# EAGLE design BreakOutBoardIpod (EAGLE 5.10)
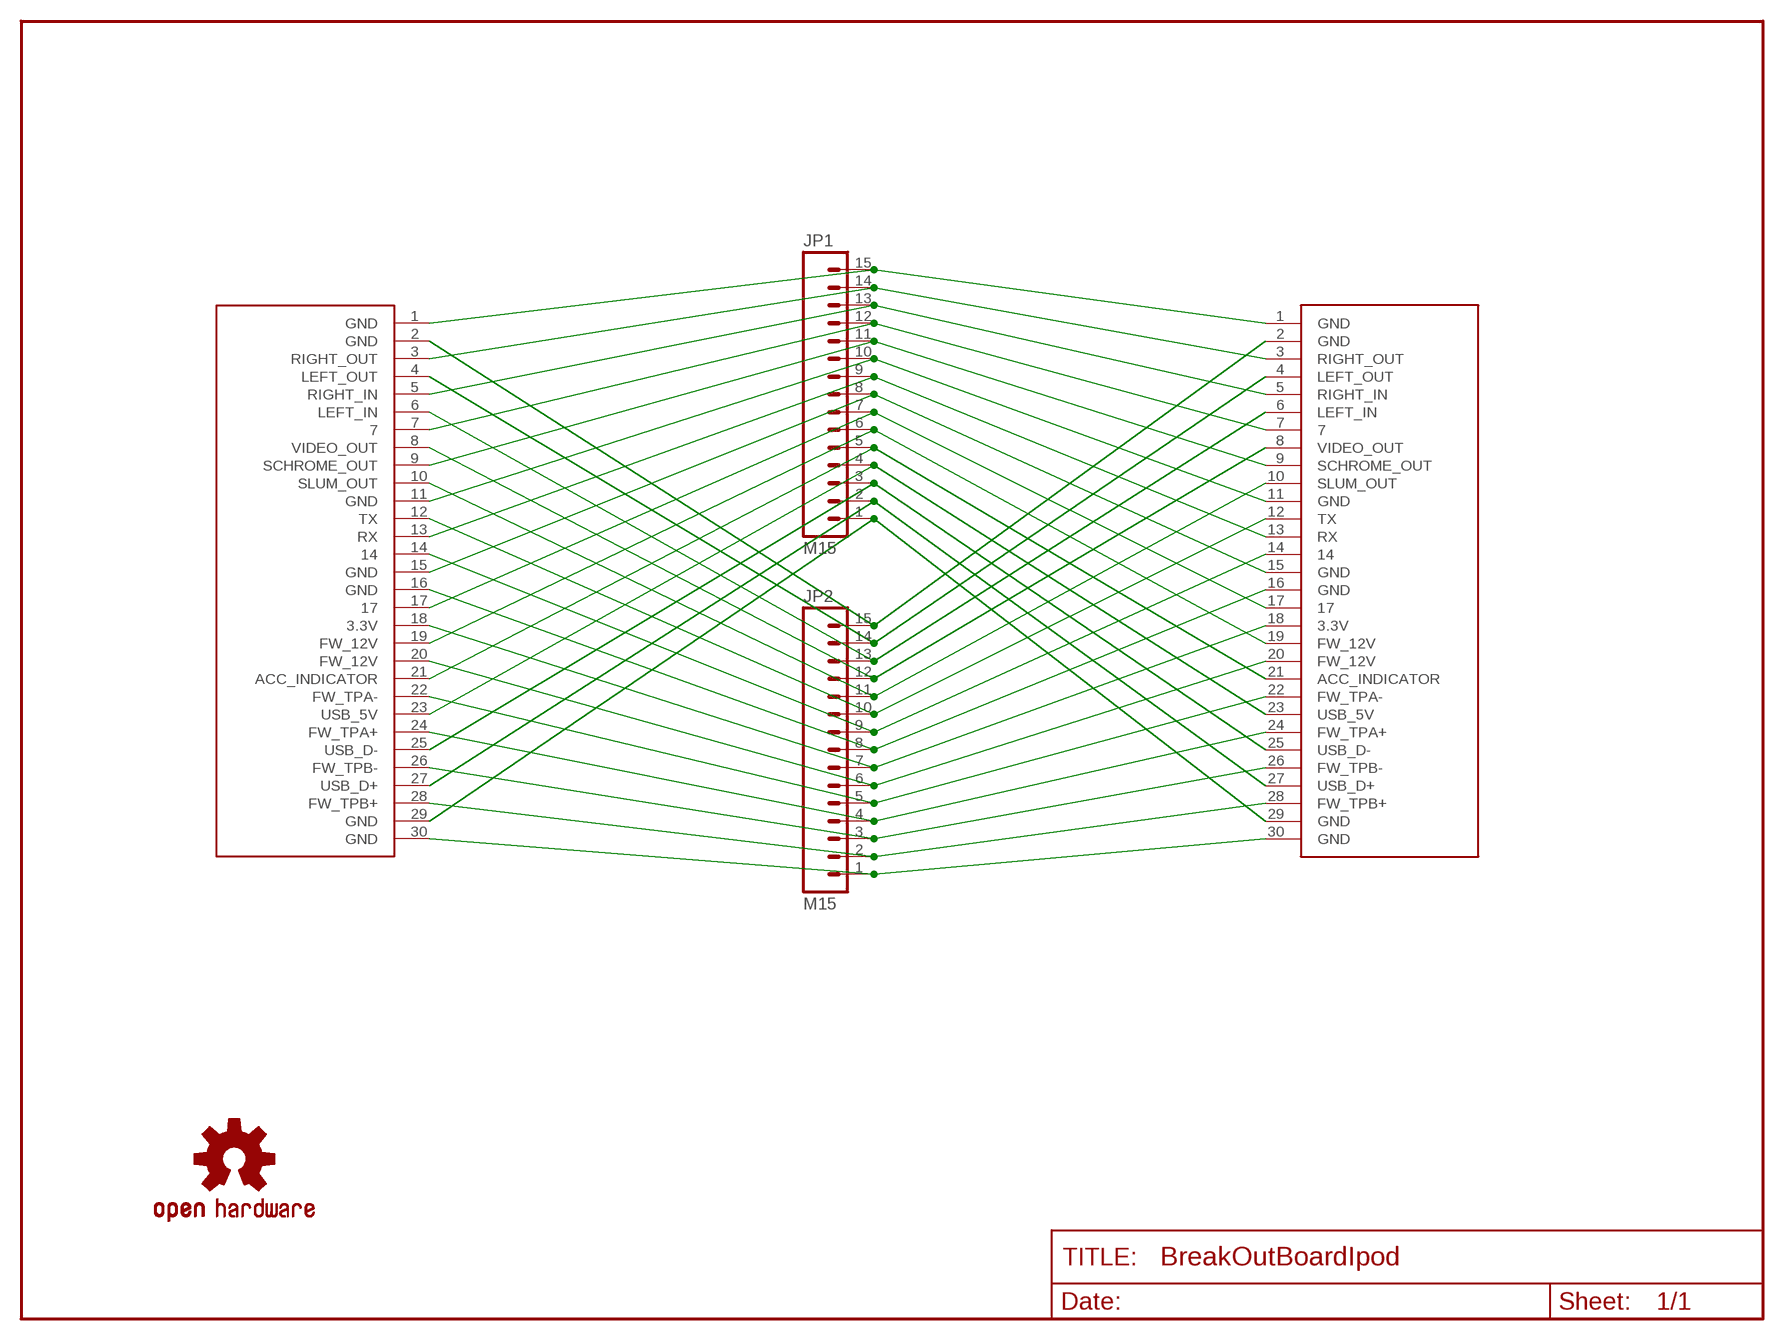
[diagram p0: schematic, sheet 1]

## Parts
J1  IPOD_FEMALE_CONNECTOR  [IPOD_FEMALE_CONNECTOR]
JP1  M15  [1X15]
JP2  M15  [1X15]
U$2  IPOD_CONNECTOR_MALE  [IPOD_MALE_CONNECTOR]
U$3  OSHW-LOGOM  [OSHW-LOGO-M]

## Nets
IPOD1: J1.1(GND) JP1.15 U$2.1(GND)
IPOD2: J1.2(GND) JP2.15 U$2.2(GND)
IPOD3: J1.3(RIGHT_OUT) JP1.14 U$2.3(RIGHT_OUT)
IPOD4: J1.4(LEFT_OUT) JP2.14 U$2.4(LEFT_OUT)
IPOD5: J1.5(RIGHT_IN) JP1.13 U$2.5(RIGHT_IN)
IPOD6: J1.6(LEFT_IN) JP2.13 U$2.6(LEFT_IN)
IPOD7: J1.7 JP1.12 U$2.7
IPOD8: J1.8(VIDEO_OUT) JP2.12 U$2.8(VIDEO_OUT)
IPOD9: J1.9(SCHROME_OUT) JP1.11 U$2.9(SCHROME_OUT)
IPOD10: J1.10(SLUM_OUT) JP2.11 U$2.10(SLUM_OUT)
IPOD11: J1.11(GND) JP1.10 U$2.11(GND)
IPOD12: J1.12(TX) JP2.10 U$2.12(TX)
IPOD13: J1.13(RX) JP1.9 U$2.13(RX)
IPOD14: J1.14 JP2.9 U$2.14
IPOD15: J1.15(GND) JP1.8 U$2.15(GND)
IPOD16: J1.16(GND) JP2.8 U$2.16(GND)
IPOD17: J1.17 JP1.7 U$2.17
IPOD18: J1.18(3.3V) JP2.7 U$2.18(3.3V)
IPOD19: J1.19(FW_12V) JP1.6 U$2.19(FW_12V)
IPOD20: J1.20(FW_12V) JP2.6 U$2.20(FW_12V)
IPOD21: J1.21(ACC_INDICATOR) JP1.5 U$2.21(ACC_INDICATOR)
IPOD22: J1.22(FW_TPA-) JP2.5 U$2.22(FW_TPA-)
IPOD23: J1.23(USB_5V) JP1.4 U$2.23(USB_5V)
IPOD24: J1.24(FW_TPA+) JP2.4 U$2.24(FW_TPA+)
IPOD25: J1.25(USB_D-) JP1.3 U$2.25(USB_D-)
IPOD26: J1.26(FW_TPB-) JP2.3 U$2.26(FW_TPB-)
IPOD27: J1.27(USB_D+) JP1.2 U$2.27(USB_D+)
IPOD28: J1.28(FW_TPB+) JP2.2 U$2.28(FW_TPB+)
IPOD29: J1.29(GND) JP1.1 U$2.29(GND)
IPOD30: J1.30(GND) JP2.1 U$2.30(GND)

## Library data of the parts
J1 = FiveVolt:IPOD_FEMALE_CONNECTOR
JP1 JP2 = SparkFun:M15: Header 15 Standard 15-pin 0.1" header. Use with straight break away headers (SKU : PRT-00116), right angle break away headers (PRT-00553), swiss pins (PRT-00743), machine pins (PRT-00117), and female headers (PRT-00115).
U$2 = SparkFun:IPOD_CONNECTOR_MALE: iPod Male Connector This is the connector that will insert into an iPods. Use this connector to gain access to the various iPod pins. Schematic and footprint are not yet production proven. The PCB thickness must be more thin than the standard 0.062" FR4. Spark Fun Electronics SKU : DEV-00633
U$3 = SparkFun:OSHW-LOGO: Open Source Hardware Logo This logo indicates the piece of hardware it is found on incorporates a OSHW license and/or adheres to the definition of open source hardware found here: http://freedomdefined.org/OSHW

## Board
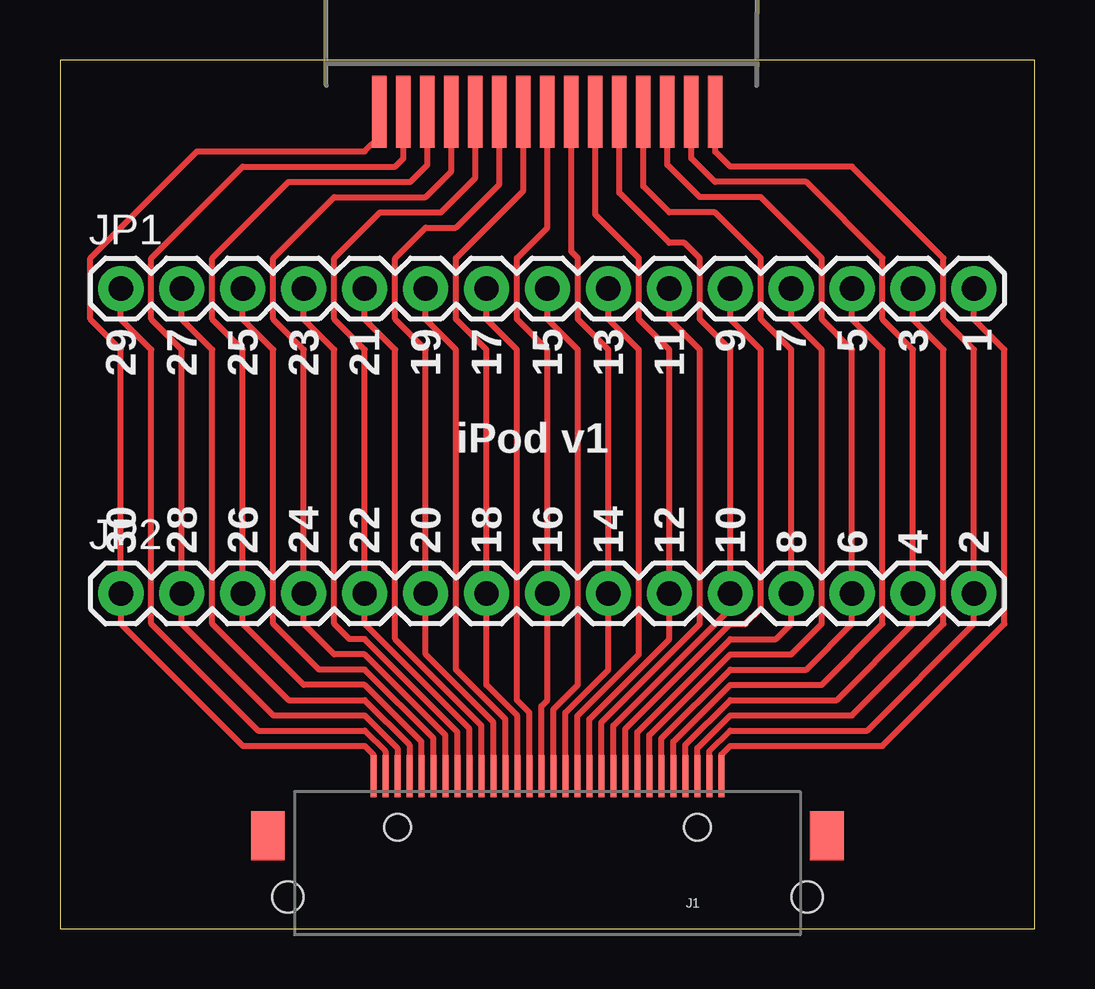
[diagram p1: board, top side]
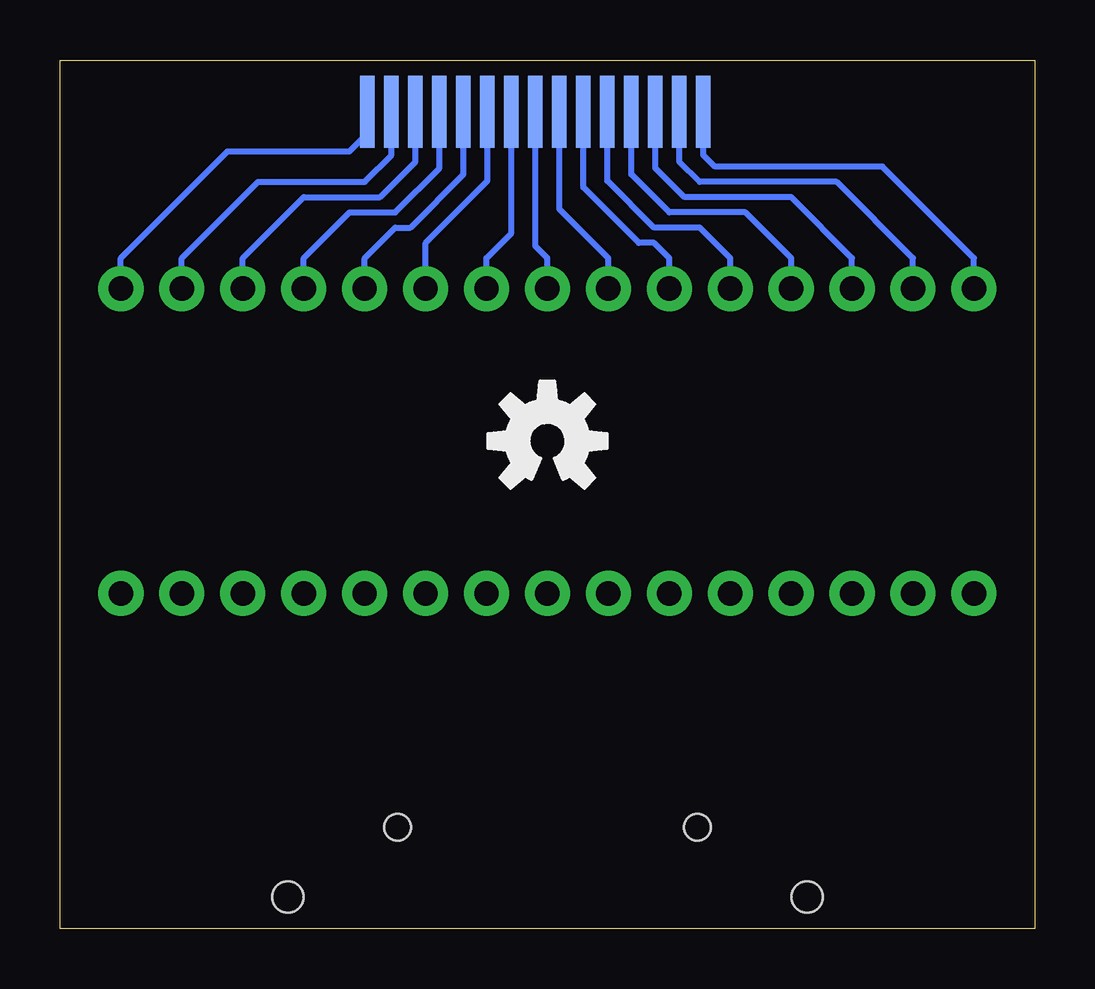
[diagram p2: board, bottom side, seen from below]

Size 40.64 x 36.2 mm. Coordinates in mm from the lower left corner, seen from the top.
Outline: 0,0 40.64,0 40.64,36.2 0,36.2 0,0
Copper layers (1*16): Top 0.035mm / dielectric 1.5mm / Bottom 0.035mm
Design rules "ITead_rule": minimum track width 6mil, minimum drill 12mil, track to track 6mil, track to pad 6mil, pad to pad 6mil, via to via 6mil, smd to smd 0mil, copper to edge 10mil, drill to drill 10mil, minimum pad ring 10mil, minimum via ring 6mil, stop-mask expansion 2mil, vias tented up to drill 100mil, thermal gap 10mil

### Footprints (pad centres in the part's own frame; a part is rotated, then mirrored left to right if it is on the bottom)
IPOD_FEMALE_CONNECTOR = smd 0.254 x 1.75: 1 -7.25,0; 2 -6.75,0; 3 -6.25,0; 4 -5.75,0; 5 -5.25,0; 6 -4.75,0; 7 -4.25,0; 8 -3.75,0; 9 -3.25,0; 10 -2.75,0; 11 -2.25,0; 12 -1.75,0; 13 -1.25,0; 14 -0.75,0; 15 -0.25,0; 16 0.25,0; 17 0.75,0; 18 1.25,0; 19 1.75,0; 20 2.25,0; 21 2.75,0; 22 3.25,0; 23 3.75,0; 24 4.25,0; 25 4.75,0; 26 5.25,0; 27 5.75,0; 28 6.25,0; 29 6.75,0; 30 7.25,0 | smd 1.4 x 2.05: 31 -11.65,2.475; 32 11.65,2.475 | hole 1.1: 6.25,2.125; -6.25,2.125 | hole 1.3: 10.825,5.025; -10.825,5.025
1X15 = drill 1.016 pad 1.88 round: 1 0,0; 2 2.54,0; 3 5.08,0; 4 7.62,0; 5 10.16,0; 6 12.7,0; 7 15.24,0; 8 17.78,0; 9 20.32,0; 10 22.86,0; 11 25.4,0; 12 27.94,0; 13 30.48,0; 14 33.02,0; 15 35.56,0
IPOD_MALE_CONNECTOR = smd 0.6 x 3 bottom: 1 7.5,0; 3 6.5,0; 5 5.5,0; 7 4.5,0; 9 3.5,0; 11 2.5,0; 13 1.5,0; 15 0.5,0; 17 -0.5,0; 19 -1.5,0; 21 -2.5,0; 23 -3.5,0; 25 -4.5,0; 27 -5.5,0; 29 -6.5,0 | smd 0.6 x 3: 2 7,0; 4 6,0; 6 5,0; 8 4,0; 10 3,0; 12 2,0; 14 1,0; 16 0,0; 18 -1,0; 20 -2,0; 22 -3,0; 24 -4,0; 26 -5,0; 28 -6,0; 30 -7,0

### Placement (x,y rotation side)
J1  20.32,6.35 180 top
JP1  2.54,26.67 0 top
JP2  2.54,13.97 0 top
U$2  20.32,34.04 0 top
U$3  20.32,20.32 0 bottom

### Tracks (layer width: path | path; a pad name or v marks a point on that pad's centre or on a via)
IPOD1
  Top 0.254: JP1.15 38.1,25.4 39.37,24.13 39.37,12.7 34.29,7.62 27.94,7.62 27.57,7.25 J1.1
  Bottom 0.254: U$2.1 27.82,33.14 28.57,32.38 33.66,32.38 38.1,27.94 JP1.15
IPOD2
  Top 0.254: J1.2 27.07,7.38 27.94,8.26 33.66,8.26 38.1,12.7 JP2.15 38.1,24.13 36.83,25.4 36.83,27.94 33.02,31.75 27.94,31.75 27.32,32.37 U$2.2
IPOD3
  Top 0.254: JP1.14 35.56,25.4 36.83,24.13 36.83,12.7 33.02,8.89 27.94,8.89 26.57,7.52 J1.3
  Bottom 0.254: U$2.3 26.82,32.23 27.94,31.11 32.38,31.11 35.56,27.94 JP1.14
IPOD4
  Top 0.254: J1.4 26.07,7.66 27.94,9.53 32.38,9.53 35.56,12.7 JP2.14 35.56,24.13 34.29,25.4 34.29,27.94 31.11,31.11 27.3,31.11 26.32,32.1 U$2.4
IPOD5
  Top 0.254: JP1.13 33.02,25.4 34.29,24.13 34.29,12.7 31.75,10.16 27.94,10.16 25.57,7.79 J1.5
  Bottom 0.254: U$2.5 25.82,31.96 27.3,30.48 30.48,30.48 33.02,27.94 JP1.13
IPOD6
  Top 0.254: J1.6 25.07,7.92 27.94,10.79 31.11,10.79 33.02,12.7 JP2.13 33.02,24.13 31.75,25.4 31.75,27.94 29.21,30.48 26.67,30.48 25.32,31.83 U$2.6
IPOD7
  Top 0.254: JP1.12 30.48,25.4 31.75,24.13 31.75,12.7 30.48,11.43 27.94,11.43 24.57,8.06 J1.7
  Bottom 0.254: U$2.7 24.82,31.7 26.67,29.84 28.57,29.84 30.48,27.94 JP1.12
IPOD8
  Top 0.254: J1.8 24.07,8.2 27.94,12.06 29.84,12.06 30.48,12.7 JP2.12 30.48,24.13 29.21,25.4 29.21,27.94 27.3,29.84 25.4,29.84 24.32,30.93 U$2.8
IPOD9
  Top 0.254: JP1.11 27.94,25.4 29.21,24.13 29.21,13.34 28.57,12.7 27.94,12.7 23.57,8.33 J1.9
  Bottom 0.254: U$2.9 23.82,31.43 26.04,29.21 26.67,29.21 27.94,27.94 JP1.11
IPOD10
  Top 0.254: J1.10 23.07,8.46 27.94,13.34 JP2.11 27.94,24.13 26.67,25.4 26.67,27.94 26.04,28.57 25.4,28.57 23.32,30.66 U$2.10
IPOD11
  Top 0.254: JP1.10 25.4,25.4 26.67,24.13 26.67,12.7 22.57,8.6 J1.11
  Bottom 0.254: U$2.11 22.82,31.16 25.4,28.57 JP1.10
IPOD12
  Top 0.254: J1.12 22.07,8.73 25.4,12.06 JP2.10 25.4,24.13 24.13,25.4 24.13,27.94 22.32,29.75 U$2.12
IPOD13
  Top 0.254: JP1.9 22.86,25.4 24.13,24.13 24.13,11.43 21.57,8.87 J1.13
  Bottom 0.254: U$2.13 21.82,28.98 22.86,27.94 JP1.9
IPOD14
  Top 0.254: U$2.14 21.32,28.21 21.59,27.94 21.59,25.4 22.86,24.13 JP2.9 22.86,10.79 21.07,9.01 J1.14
IPOD15
  Top 0.254: JP1.8 20.32,25.4 21.59,24.13 21.59,10.16 20.57,9.14 J1.15
  Bottom 0.254: U$2.15 20.82,28.44 20.32,27.94 JP1.8
IPOD16
  Top 0.254: U$2.16 20.32,29.21 19.05,27.94 19.05,25.4 20.32,24.13 JP2.8 20.32,9.53 20.07,9.28 J1.16
IPOD17
  Top 0.254: JP1.7 17.78,25.4 19.05,24.13 19.05,9.53 19.57,9.01 J1.17
  Bottom 0.254: U$2.17 19.82,29.98 17.78,27.94 JP1.7
IPOD18
  Top 0.254: J1.18 19.07,8.87 17.78,10.16 JP2.7 17.78,24.13 16.51,25.4 16.51,27.94 19.32,30.75 U$2.18
IPOD19
  Top 0.254: JP1.6 15.24,25.4 16.51,24.13 16.51,10.79 18.57,8.73 J1.19
  Bottom 0.254: U$2.19 18.82,30.89 16.51,28.57 15.88,28.57 15.24,27.94 JP1.6
IPOD20
  Top 0.254: J1.20 18.07,8.6 15.24,11.43 JP2.6 15.24,24.13 13.97,25.4 13.97,27.94 15.24,29.21 16.51,29.21 18.32,31.02 U$2.20
IPOD21
  Top 0.254: JP1.5 12.7,25.4 13.97,24.13 13.97,12.06 17.57,8.46 J1.21
  Bottom 0.254: U$2.21 17.82,31.16 15.88,29.21 13.97,29.21 12.7,27.94 JP1.5
IPOD22
  Top 0.254: J1.22 17.07,8.33 12.7,12.7 JP2.5 12.7,24.13 11.43,25.4 11.43,27.94 13.34,29.84 15.88,29.84 17.32,31.29 U$2.22
IPOD23
  Top 0.254: JP1.4 10.16,25.4 11.43,24.13 11.43,12.7 12.06,12.06 12.7,12.06 16.57,8.2 J1.23
  Bottom 0.254: U$2.23 16.82,31.43 15.24,29.84 12.06,29.84 10.16,27.94 JP1.4
IPOD24
  Top 0.254: J1.24 16.07,8.06 12.7,11.43 11.43,11.43 10.16,12.7 JP2.4 10.16,24.13 8.89,25.4 8.89,27.94 11.43,30.48 15.24,30.48 16.32,31.56 U$2.24
IPOD25
  Top 0.254: JP1.3 7.62,25.4 8.89,24.13 8.89,12.7 10.79,10.79 12.7,10.79 15.57,7.92 J1.25
  Bottom 0.254: U$2.25 15.82,31.7 14.61,30.48 10.16,30.48 7.62,27.94 JP1.3
IPOD26
  Top 0.254: J1.26 15.07,7.79 12.7,10.16 10.16,10.16 7.62,12.7 JP2.3 7.62,24.13 6.35,25.4 6.35,27.94 9.53,31.11 14.61,31.11 15.32,31.83 U$2.26
IPOD27
  Top 0.254: JP1.2 5.08,25.4 6.35,24.13 6.35,12.7 9.53,9.53 12.7,9.53 14.57,7.66 J1.27
  Bottom 0.254: U$2.27 14.82,31.96 13.97,31.11 8.26,31.11 5.08,27.94 JP1.2
IPOD28
  Top 0.254: J1.28 14.07,7.52 12.7,8.89 8.89,8.89 5.08,12.7 JP2.2 5.08,24.13 3.81,25.4 3.81,27.94 7.62,31.75 13.97,31.75 14.32,32.1 U$2.28
IPOD29
  Top 0.254: JP1.1 2.54,25.4 3.81,24.13 3.81,12.7 8.26,8.26 12.7,8.26 13.57,7.38 J1.29
  Bottom 0.254: U$2.29 13.82,32.23 13.34,31.75 6.35,31.75 2.54,27.94 JP1.1
IPOD30
  Top 0.254: J1.30 13.07,7.25 12.7,7.62 7.62,7.62 2.54,12.7 JP2.1 2.54,24.13 1.27,25.4 1.27,27.94 5.71,32.38 12.7,32.38 13.34,33.02 13.34,34.02 U$2.30

### Text on the board
tPlace: 29 | 27 | 25 | 23 | 21 | 19 | 17 | 15 | 13 | 11 | 9 | 7 | 5 | 3 | 1 | iPod v1 | 30 | 28 | 26 | 24 | 22 | 20 | 18 | 16 | 14 | 12 | 10 | 8 | 6 | 4 | 2